# Altium schematic sheet Sheet1.SchDoc
size A; SheetNumber: 1; SheetTotal: 1; SPICEModelCacheMJZUGUQY: <root> / <DocumentId>MJZUGUQY</DocumentId> / </root>
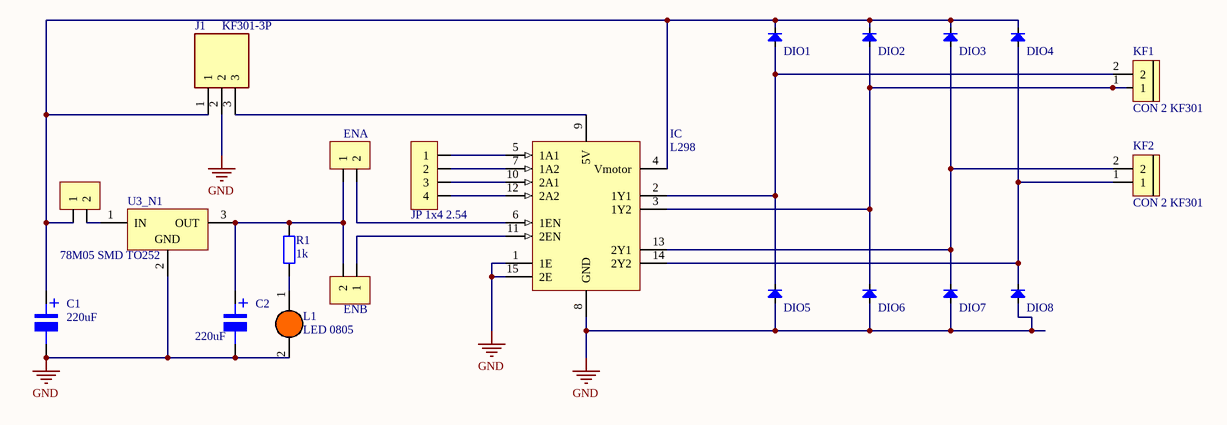
[diagram p0: Sheet1.SchDoc]

## Parts
(Parts that share a designator on the sheet are numbered #1, #2 ... from top to bottom, then left to right.)
C1  220uF  [tu nhom 8 (f)]
C2  220uF  [tu nhom 10 (g)]
DIO1  Diode SMD  [DIO-SMD-106]  (value not drawn)
DIO2  Diode SMD  [DIO-SMD-106]  (value not drawn)
DIO3  Diode SMD  [DIO-SMD-106]  (value not drawn)
DIO4  Diode SMD  [DIO-SMD-106]  (value not drawn)
DIO5  Diode SMD  [DIO-SMD-106]  (value not drawn)
DIO6  Diode SMD  [DIO-SMD-106]  (value not drawn)
DIO7  Diode SMD  [DIO-SMD-106]  (value not drawn)
DIO8  Diode SMD  [DIO-SMD-106]  (value not drawn)
IC  L298  [DIP15SL2]
J1  KF301-3P  [KF3013P]
JP1#1  JP 1x4 2.54  [JP 1x4 DT]
JP1#2  (no value)  [JP 1x2 DT]
JP2  ENA  [JP 1x2 DT]
JP3  ENB  [JP 1x2 DT]
KF1  CON 2 KF301  [Con 2 KF301 5.08]
KF2  CON 2 KF301  [Con 2 KF301 5.08]
L1  LED 0805  [LED-0805-Orange]
R1  1k  [tro smd 0805]
U3_N1  78M05 SMD TO252  [TO252]

## Nets
GND: C1.2 C2.2 DIO5.1(A) DIO6.1(A) DIO7.1(A) DIO8.1(A) IC.1(1E) IC.8(GND) IC.15(2E) J1.2 L1.2(K) U3_N1.2(GND)
NetC1_1: C1.1 DIO1.2(K) DIO2.2(K) DIO3.2(K) DIO4.2(K) IC.4(Vmotor) J1.1 JP1#2.1
NetC2_1: C2.1 JP2.1 JP3.2 R1.2 U3_N1.3(OUT)
NetDIO1_1: DIO1.1(A) DIO5.2(K) IC.2(1Y1) KF1.2
NetDIO2_1: DIO2.1(A) DIO6.2(K) IC.3(1Y2) KF1.1
NetDIO3_1: DIO3.1(A) DIO7.2(K) IC.13(2Y1) KF2.2
NetDIO4_1: DIO4.1(A) DIO8.2(K) IC.14(2Y2) KF2.1
NetIC_5: IC.5(1A1) JP1#1.1
NetIC_6: IC.6(1EN) JP2.2
NetIC_7: IC.7(1A2) JP1#1.2
NetIC_9: IC.9(5V) J1.3
NetIC_10: IC.10(2A1) JP1#1.3
NetIC_11: IC.11(2EN) JP3.1
NetIC_12: IC.12(2A2) JP1#1.4
NetJP1#2_2: JP1#2.2 U3_N1.1(IN)
NetL1_1: L1.1(A) R1.1

## Notes on the sheet
- (in symbol Tu Nhom 220uF 25V) +
- (in symbol Tu Nhom 220uF 50V) +

## Library data of the parts
C1 = Tu Nhom 220uF 25V: Dán; Don_Vi: Con; So_Chan: 2; Ten_Linh_Kien: Tụ Nhôm 220uF 25V; Ma_Hang: MH002221; Chung_Loai: Dán; Kieu_Chan: *
C2 = Tu Nhom 220uF 50V: Dán; Don_Vi: Con; So_Chan: 2; Ten_Linh_Kien: Tụ Nhôm 220uF 50V 10x10.2MM; Ma_Hang: MH002228; Chung_Loai: Dán; Kieu_Chan: *
DIO1-DIO8 = Diode SMD: Default Diode; Code - JEDEC: DO-214-AB; Value: 1N5007; Published: 8-Jun-2000; Revision: July-2002: Re-released for DXP Platform.; Publisher: Altium Limited
IC = L298: Dual Full-H Driver; Note: The tab is elec is connected to GND pin; Published: 15-May-2002; DatasheetVersion: Jun-1990; PackageReference: KV015; Publisher: Altium Limited; PackageDescription: TO, Thru-Hole, Vertical, Heatsink Mounted; 15 Bent Staggered Leads; Pitch 1.27 mm; ComponentLink1Description: Manufacturer Link; ComponentLink1URL: http://www.ti.com/
J1 = KF301-3P: Terminal Block 5mm Pitch 3 Poles; Manufacturer_Name: Handson Technology; Geometry.Height: 10mm; Manufacturer_Part_Number: KF301-3P; Mouser Part Number: *; Mouser Price/Stock: *; Arrow Part Number: *; Arrow Price/Stock: *; Datasheet Link: http://www.handsontec.com/dataspecs/terminal%20block-5mm.pdf
JP1#1 = JP 1x4 2.54 Duc Thang: Cắm; Ten_Linh_Kien: Jump Đơn Đực 2.54MM 1x40P Thẳng 11MM; Don_Vi: Con; Ma_Hang: MH000903; Ghi_Chu: *; Kieu_Chan: *; Chung_Loai: Cắm
JP1#2 JP2 JP3 = JP 1x2 2.54 Duc Thang: Cắm; Ten_Linh_Kien: Jump Đơn Đực 2.54MM 1x40P Thẳng 11MM; Don_Vi: Con; Ma_Hang: MH000903; Ghi_Chu: *; Kieu_Chan: *; Chung_Loai: Cắm
KF1 KF2 = CON 2 KF301: Cắm; Ma_Hang: MH000987; Ten_Linh_Kien: CON 2 KF301-2P 5.08MM Xanh Dương; Chung_Loai: Cắm; Ghi_Chu: *; Kieu_Chan: *; Don_Vi: Con
L1 = LED 0805 Cam: Dán; Don_Vi: Con; Ma_Hang: MH002328; Ten_Linh_Kien: LED 0805 Màu Cam ( Orange); Ghi_Chu: *; Kieu_Chan: *; Chung_Loai: Dán
R1 = Tro 0805 5% 1k: Dán; Don_Vi: Con; So_Chan: 2; Ten_Linh_Kien: Trở 0805 5% 1k; Ma_Hang: MH005234; Chung_Loai: Dán; Kieu_Chan: *
U3_N1 = 78M05 SMD TO252: Dán; Don_Vi: Con; Ten_Linh_Kien: 78M05 TO252; Ma_Hang: MH001917; Ghi_Chu: *; Kieu_Chan: *; Chung_Loai: Dán